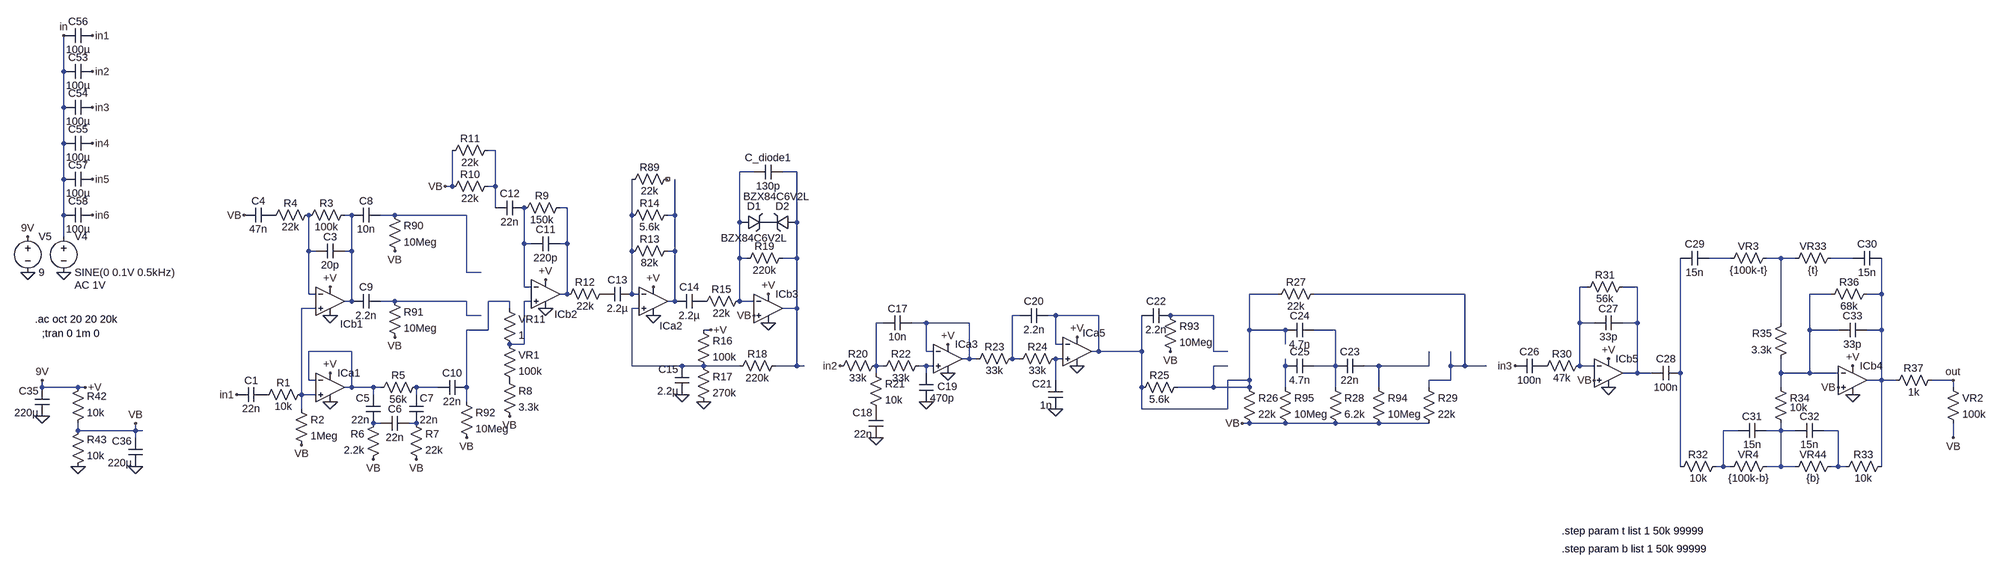
[diagram p0: schematic PocketAmpMK2.asc]
PocketAmpMK2.asc, the LTspice schematic file:
Version 4
SHEET 1 2672 1052
WIRE -1776 -928 -1776 -1008
WIRE -1776 -848 -1776 -928
WIRE -1776 -768 -1776 -848
WIRE -656 -752 -672 -752
WIRE -80 -704 -112 -704
WIRE 16 -704 -16 -704
WIRE -1776 -688 -1776 -768
WIRE -752 -672 -752 -752
WIRE -752 -672 -768 -672
WIRE -656 -672 -656 -752
WIRE -656 -672 -672 -672
WIRE -656 -624 -656 -672
WIRE -496 -624 -512 -624
WIRE -1776 -608 -1776 -688
WIRE -976 -608 -992 -608
WIRE -880 -608 -912 -608
WIRE -720 -608 -880 -608
WIRE -352 -608 -352 -688
WIRE -256 -608 -256 -688
WIRE -256 -608 -272 -608
WIRE -112 -592 -112 -704
WIRE 16 -592 16 -704
WIRE -1776 -560 -1776 -608
WIRE -592 -544 -592 -624
WIRE -576 -544 -592 -544
WIRE -496 -544 -496 -624
WIRE -496 -544 -512 -544
WIRE -1072 -528 -1072 -608
WIRE -1056 -528 -1072 -528
WIRE -976 -528 -976 -608
WIRE -976 -528 -992 -528
WIRE -352 -528 -352 -608
WIRE -256 -528 -256 -608
WIRE -256 -528 -272 -528
WIRE -112 -512 -112 -592
WIRE -96 -512 -112 -512
WIRE 16 -512 16 -592
WIRE 16 -512 -16 -512
WIRE 2096 -512 2048 -512
WIRE 2208 -512 2176 -512
WIRE 2240 -512 2208 -512
WIRE 2368 -512 2320 -512
WIRE -720 -480 -720 -608
WIRE -688 -480 -720 -480
WIRE -592 -448 -592 -544
WIRE -576 -448 -592 -448
WIRE 1776 -448 1760 -448
WIRE 1888 -448 1856 -448
WIRE -1072 -432 -1072 -528
WIRE -1056 -432 -1072 -432
WIRE -496 -432 -496 -544
WIRE -496 -432 -512 -432
WIRE -352 -432 -352 -528
WIRE -336 -432 -352 -432
WIRE 1088 -432 1024 -432
WIRE 1504 -432 1168 -432
WIRE 2320 -432 2272 -432
WIRE 2432 -432 2432 -512
WIRE 2432 -432 2400 -432
WIRE -976 -416 -976 -528
WIRE -976 -416 -992 -416
WIRE -880 -416 -912 -416
WIRE -720 -416 -880 -416
WIRE -624 -416 -672 -416
WIRE -576 -416 -592 -416
WIRE -256 -416 -256 -528
WIRE -256 -416 -272 -416
WIRE -112 -416 -112 -512
WIRE -80 -416 -112 -416
WIRE -1056 -400 -1088 -400
WIRE -624 -400 -624 -416
WIRE -336 -400 -352 -400
WIRE 16 -400 16 -512
WIRE 16 -400 -16 -400
WIRE -720 -384 -720 -416
WIRE -688 -384 -720 -384
WIRE 512 -384 496 -384
WIRE 592 -384 576 -384
WIRE 688 -384 592 -384
WIRE 944 -384 848 -384
WIRE 208 -368 192 -368
WIRE 304 -368 272 -368
WIRE 400 -368 304 -368
WIRE 1760 -368 1760 -448
WIRE 1792 -368 1760 -368
WIRE 1888 -368 1888 -448
WIRE 1888 -368 1856 -368
WIRE 2208 -368 2208 -512
WIRE -672 -352 -672 -416
WIRE -672 -352 -720 -352
WIRE -176 -352 -192 -352
WIRE 1024 -352 1024 -432
WIRE 1104 -352 1024 -352
WIRE 1216 -352 1168 -352
WIRE 2272 -352 2272 -432
WIRE 2336 -352 2272 -352
WIRE 2432 -352 2432 -432
WIRE 2432 -352 2400 -352
WIRE -592 -320 -592 -416
WIRE -592 -320 -624 -320
WIRE 592 -320 592 -384
WIRE 608 -320 592 -320
WIRE 1104 -320 1104 -352
WIRE -976 -304 -1072 -304
WIRE 304 -304 304 -368
WIRE 320 -304 304 -304
WIRE 688 -304 688 -384
WIRE 688 -304 672 -304
WIRE 784 -304 784 -384
WIRE 784 -304 688 -304
WIRE 944 -304 944 -384
WIRE 976 -304 944 -304
WIRE 400 -288 400 -368
WIRE 400 -288 384 -288
WIRE 416 -288 400 -288
WIRE 496 -288 496 -384
WIRE 512 -288 496 -288
WIRE 608 -288 592 -288
WIRE -352 -272 -352 -400
WIRE -240 -272 -352 -272
WIRE -192 -272 -240 -272
WIRE -112 -272 -192 -272
WIRE 16 -272 16 -400
WIRE 16 -272 -32 -272
WIRE 32 -272 16 -272
WIRE 192 -272 192 -368
WIRE 208 -272 192 -272
WIRE 304 -272 288 -272
WIRE 320 -272 304 -272
WIRE 976 -272 944 -272
WIRE 1104 -272 1104 -288
WIRE 1216 -272 1216 -352
WIRE 1216 -272 1168 -272
WIRE 1312 -272 1280 -272
WIRE 1424 -272 1424 -304
WIRE 1424 -272 1312 -272
WIRE 1472 -272 1472 -304
WIRE 1504 -272 1504 -432
WIRE 1504 -272 1472 -272
WIRE 1552 -272 1504 -272
WIRE 1760 -272 1760 -368
WIRE 1792 -272 1760 -272
WIRE 192 -256 192 -272
WIRE 304 -256 304 -272
WIRE 1888 -256 1888 -368
WIRE 1888 -256 1856 -256
WIRE 1920 -256 1888 -256
WIRE 1984 -256 1984 -512
WIRE 2208 -256 2208 -288
WIRE 2272 -256 2272 -352
WIRE 2272 -256 2208 -256
WIRE 2336 -256 2272 -256
WIRE -1072 -240 -1072 -304
WIRE -1056 -240 -1072 -240
WIRE 592 -240 592 -288
WIRE 1024 -240 1024 -352
WIRE 1024 -240 976 -240
WIRE 1472 -240 1472 -272
WIRE 1472 -240 1424 -240
WIRE 2432 -240 2432 -352
WIRE 2432 -240 2400 -240
WIRE 2464 -240 2432 -240
WIRE 2592 -240 2544 -240
WIRE -1824 -224 -1824 -240
WIRE -1744 -224 -1824 -224
WIRE -1728 -224 -1744 -224
WIRE -976 -224 -976 -304
WIRE -976 -224 -992 -224
WIRE -928 -224 -976 -224
WIRE -912 -224 -928 -224
WIRE -784 -224 -832 -224
WIRE -720 -224 -720 -352
WIRE 784 -224 784 -304
WIRE 944 -224 944 -272
WIRE 944 -224 864 -224
WIRE 1024 -224 1024 -240
WIRE 1024 -224 944 -224
WIRE 1104 -224 1104 -272
WIRE 1216 -224 1216 -272
WIRE 1312 -224 1312 -272
WIRE 1424 -224 1424 -240
WIRE 2208 -224 2208 -256
WIRE 2592 -224 2592 -240
WIRE -1088 -208 -1088 -400
WIRE -1056 -208 -1088 -208
WIRE -928 -208 -928 -224
WIRE -832 -208 -832 -224
WIRE -720 -192 -720 -224
WIRE -1088 -176 -1088 -208
WIRE 784 -176 784 -224
WIRE 976 -176 976 -240
WIRE 976 -176 784 -176
WIRE -912 -144 -928 -144
WIRE -832 -144 -848 -144
WIRE 1024 -144 1008 -144
WIRE 1104 -144 1024 -144
WIRE 1216 -144 1104 -144
WIRE 1312 -144 1216 -144
WIRE 1424 -144 1312 -144
WIRE -1744 -128 -1744 -144
WIRE -1616 -128 -1616 -144
WIRE -1616 -128 -1744 -128
WIRE -1600 -128 -1616 -128
WIRE 2112 -128 2080 -128
WIRE 2208 -128 2208 -144
WIRE 2208 -128 2176 -128
WIRE 2240 -128 2208 -128
WIRE 2336 -128 2304 -128
WIRE -1616 -112 -1616 -128
WIRE 2592 -112 2592 -144
WIRE 1984 -48 1984 -256
WIRE 2080 -48 2080 -128
WIRE 2080 -48 2064 -48
WIRE 2096 -48 2080 -48
WIRE 2208 -48 2208 -128
WIRE 2208 -48 2176 -48
WIRE 2240 -48 2208 -48
WIRE 2336 -48 2336 -128
WIRE 2336 -48 2320 -48
WIRE 2352 -48 2336 -48
WIRE 2432 -48 2432 -240
FLAG -1232 -208 in1
FLAG -1024 -192 0
FLAG -1024 -256 +V
FLAG -1024 -448 +V
FLAG -1024 -384 0
FLAG -192 -192 0
FLAG -240 -208 0
FLAG -304 -448 +V
FLAG -304 -384 0
FLAG 192 -112 0
FLAG 304 -192 0
FLAG 352 -320 +V
FLAG 352 -256 0
FLAG 592 -176 0
FLAG 640 -336 +V
FLAG 640 -272 0
FLAG -1824 -160 0
FLAG -1744 -48 0
FLAG -1616 -48 0
FLAG -1616 -144 VB
FLAG -1824 -240 9V
FLAG -1776 -480 0
FLAG -1776 -1008 in
FLAG -1856 -480 0
FLAG -1856 -560 9V
FLAG -1712 -1008 in1
FLAG -1712 -928 in2
FLAG -1712 -848 in3
FLAG -1712 -768 in4
FLAG -1712 -688 in5
FLAG -1712 -608 in6
FLAG -1728 -224 +V
FLAG -1088 -96 VB
FLAG -720 -112 VB
FLAG -928 -64 VB
FLAG -832 -64 VB
FLAG -1216 -608 VB
FLAG -880 -336 VB
FLAG -880 -528 VB
FLAG -544 -464 +V
FLAG -544 -400 0
FLAG -624 -160 VB
FLAG -768 -672 VB
FLAG -48 -432 +V
FLAG -48 -368 0
FLAG -176 -352 +V
FLAG -80 -384 VB
FLAG 848 -304 VB
FLAG 1008 -144 VB
FLAG 1824 -288 +V
FLAG 1824 -224 0
FLAG 1792 -240 VB
FLAG 2368 -208 0
FLAG 2368 -272 +V
FLAG 2336 -224 VB
FLAG 2592 -112 VB
FLAG 112 -272 in2
FLAG 1616 -272 in3
FLAG 2592 -240 out
SYMBOL cap -1168 -224 R90
WINDOW 0 0 32 VBottom 2
WINDOW 3 32 32 VTop 2
SYMATTR InstName C1
SYMATTR Value 22n
SYMBOL res -1104 -192 R0
SYMATTR InstName R2
SYMATTR Value 1Meg
SYMBOL UniversalOpamp2 -1024 -224 R0
SYMATTR InstName ICa1
SYMBOL res -816 -240 R90
WINDOW 0 5 56 VBottom 2
WINDOW 3 27 56 VTop 2
SYMATTR InstName R5
SYMATTR Value 56k
SYMBOL cap -912 -144 R180
WINDOW 0 24 56 Left 2
WINDOW 3 24 8 Left 2
SYMATTR InstName C5
SYMATTR Value 22n
SYMBOL cap -848 -144 M180
WINDOW 0 24 56 Left 2
WINDOW 3 24 8 Left 2
SYMATTR InstName C7
SYMATTR Value 22n
SYMBOL cap -848 -160 R90
WINDOW 0 0 32 VBottom 2
WINDOW 3 32 32 VTop 2
SYMATTR InstName C6
SYMATTR Value 22n
SYMBOL res -912 -160 M0
SYMATTR InstName R6
SYMATTR Value 2.2k
SYMBOL res -848 -160 R0
SYMATTR InstName R7
SYMATTR Value 22k
SYMBOL cap -720 -240 R90
WINDOW 0 0 32 VBottom 2
WINDOW 3 32 32 VTop 2
SYMATTR InstName C10
SYMATTR Value 22n
SYMBOL res -736 -208 R0
SYMATTR InstName R92
SYMATTR Value 10Meg
SYMBOL UniversalOpamp2 -1024 -416 R0
WINDOW 0 22 51 Left 2
SYMATTR InstName ICb1
SYMBOL cap -992 -544 R90
WINDOW 0 0 32 VBottom 2
WINDOW 3 32 32 VTop 2
SYMATTR InstName C3
SYMATTR Value 20p
SYMBOL res -976 -624 R90
WINDOW 0 5 56 VBottom 2
WINDOW 3 27 56 VTop 2
SYMATTR InstName R3
SYMATTR Value 100k
SYMBOL res -1056 -624 R90
WINDOW 0 5 56 VBottom 2
WINDOW 3 27 56 VTop 2
SYMATTR InstName R4
SYMATTR Value 22k
SYMBOL cap -1152 -624 R90
WINDOW 0 0 32 VBottom 2
WINDOW 3 32 32 VTop 2
SYMATTR InstName C4
SYMATTR Value 47n
SYMBOL res -400 -448 R90
WINDOW 0 5 56 VBottom 2
WINDOW 3 27 56 VTop 2
SYMATTR InstName R12
SYMATTR Value 22k
SYMBOL cap -352 -448 R90
WINDOW 0 0 32 VBottom 2
WINDOW 3 32 32 VTop 2
SYMATTR InstName C13
SYMATTR Value 2.2µ
SYMBOL UniversalOpamp2 -304 -416 R0
WINDOW 0 14 55 Left 2
SYMATTR InstName ICa2
SYMBOL res -208 -368 R0
SYMATTR InstName R16
SYMATTR Value 100k
SYMBOL res -208 -288 R0
SYMATTR InstName R17
SYMATTR Value 270k
SYMBOL cap -224 -208 R180
WINDOW 0 24 56 Left 2
WINDOW 3 24 8 Left 2
SYMATTR InstName C15
SYMATTR Value 2.2µ
SYMBOL cap -192 -432 R90
WINDOW 0 0 32 VBottom 2
WINDOW 3 32 32 VTop 2
SYMATTR InstName C14
SYMATTR Value 2.2µ
SYMBOL res 0 -528 R90
WINDOW 0 5 56 VBottom 2
WINDOW 3 27 56 VTop 2
SYMATTR InstName R19
SYMATTR Value 220k
SYMBOL zener 16 -608 R90
WINDOW 0 -4 32 VBottom 2
WINDOW 3 -57 46 VTop 2
SYMATTR InstName D2
SYMATTR Value BZX84C6V2L
SYMBOL zener -112 -608 M90
WINDOW 0 -4 32 VBottom 2
WINDOW 3 36 32 VTop 2
SYMATTR InstName D1
SYMATTR Value BZX84C6V2L
SYMBOL res 208 -288 R90
WINDOW 0 5 56 VBottom 2
WINDOW 3 27 56 VTop 2
SYMATTR InstName R20
SYMATTR Value 33k
SYMBOL res 304 -288 R90
WINDOW 0 5 56 VBottom 2
WINDOW 3 27 56 VTop 2
SYMATTR InstName R22
SYMATTR Value 33k
SYMBOL res 176 -272 R0
SYMATTR InstName R21
SYMATTR Value 10k
SYMBOL cap 208 -112 R180
WINDOW 0 24 56 Left 2
WINDOW 3 24 8 Left 2
SYMATTR InstName C18
SYMATTR Value 22n
SYMBOL cap 288 -192 M180
WINDOW 0 41 34 Left 2
WINDOW 3 24 8 Left 2
SYMATTR InstName C19
SYMATTR Value 470p
SYMBOL cap 272 -384 R90
WINDOW 0 0 32 VBottom 2
WINDOW 3 32 32 VTop 2
SYMATTR InstName C17
SYMATTR Value 10n
SYMBOL UniversalOpamp2 352 -288 R0
SYMATTR InstName ICa3
SYMBOL res 512 -304 R90
WINDOW 0 5 56 VBottom 2
WINDOW 3 27 56 VTop 2
SYMATTR InstName R23
SYMATTR Value 33k
SYMBOL res 608 -304 R90
WINDOW 0 5 56 VBottom 2
WINDOW 3 27 56 VTop 2
SYMATTR InstName R24
SYMATTR Value 33k
SYMBOL cap 608 -176 R180
WINDOW 0 24 56 Left 2
WINDOW 3 24 8 Left 2
SYMATTR InstName C21
SYMATTR Value 1n
SYMBOL cap 576 -400 R90
WINDOW 0 0 32 VBottom 2
WINDOW 3 32 32 VTop 2
SYMATTR InstName C20
SYMATTR Value 2.2n
SYMBOL UniversalOpamp2 640 -304 R0
WINDOW 0 12 -41 Left 2
SYMATTR InstName ICa5
SYMBOL res 1184 -448 R90
WINDOW 0 5 56 VBottom 2
WINDOW 3 27 56 VTop 2
SYMATTR InstName R27
SYMATTR Value 22k
SYMBOL res -1072 -224 R90
WINDOW 0 5 56 VBottom 2
WINDOW 3 27 56 VTop 2
SYMATTR InstName R1
SYMATTR Value 10k
SYMBOL cap -1808 -160 R180
WINDOW 0 24 56 Left 2
WINDOW 3 24 8 Left 2
SYMATTR InstName C35
SYMATTR Value 220µ
SYMBOL res -1760 -128 M180
WINDOW 0 36 76 Left 2
WINDOW 3 36 40 Left 2
SYMATTR InstName R42
SYMATTR Value 10k
SYMBOL res -1760 -32 M180
WINDOW 0 36 76 Left 2
WINDOW 3 36 40 Left 2
SYMATTR InstName R43
SYMATTR Value 10k
SYMBOL cap -1600 -48 R180
WINDOW 0 24 56 Left 2
WINDOW 3 24 8 Left 2
SYMATTR InstName C36
SYMATTR Value 220µ
SYMBOL voltage -1776 -576 R0
WINDOW 123 24 124 Left 2
WINDOW 39 0 0 Left 2
SYMATTR Value2 AC 1V
SYMATTR InstName V4
SYMATTR Value SINE(0 0.1V 0.5kHz)
SYMBOL voltage -1856 -576 R0
WINDOW 123 0 0 Left 0
WINDOW 39 0 0 Left 0
SYMATTR InstName V5
SYMATTR Value 9
SYMBOL cap -1712 -944 R90
WINDOW 0 0 32 VBottom 2
WINDOW 3 32 32 VTop 2
SYMATTR InstName C53
SYMATTR Value 100µ
SYMBOL cap -1712 -864 R90
WINDOW 0 0 32 VBottom 2
WINDOW 3 32 32 VTop 2
SYMATTR InstName C54
SYMATTR Value 100µ
SYMBOL cap -1712 -784 R90
WINDOW 0 0 32 VBottom 2
WINDOW 3 32 32 VTop 2
SYMATTR InstName C55
SYMATTR Value 100µ
SYMBOL cap -1712 -1024 R90
WINDOW 0 0 32 VBottom 2
WINDOW 3 32 32 VTop 2
SYMATTR InstName C56
SYMATTR Value 100µ
SYMBOL cap -1712 -704 R90
WINDOW 0 0 32 VBottom 2
WINDOW 3 32 32 VTop 2
SYMATTR InstName C57
SYMATTR Value 100µ
SYMBOL cap -1712 -624 R90
WINDOW 0 0 32 VBottom 2
WINDOW 3 32 32 VTop 2
SYMATTR InstName C58
SYMATTR Value 100µ
SYMBOL cap -912 -432 R90
WINDOW 0 0 32 VBottom 2
WINDOW 3 32 32 VTop 2
SYMATTR InstName C9
SYMATTR Value 2.2n
SYMBOL cap -912 -624 R90
WINDOW 0 0 32 VBottom 2
WINDOW 3 32 32 VTop 2
SYMATTR InstName C8
SYMATTR Value 10n
SYMBOL res -896 -432 R0
SYMATTR InstName R91
SYMATTR Value 10Meg
SYMBOL res -896 -624 R0
SYMATTR InstName R90
SYMATTR Value 10Meg
SYMBOL UniversalOpamp2 -544 -432 R0
WINDOW 0 20 45 Left 2
SYMATTR InstName ICb2
SYMBOL res -640 -416 R0
SYMATTR InstName VR11
SYMATTR Value 1
SYMBOL res -640 -336 R0
SYMATTR InstName VR1
SYMATTR Value 100k
SYMBOL res -640 -256 R0
SYMATTR InstName R8
SYMATTR Value 3.3k
SYMBOL cap -512 -560 R90
WINDOW 0 0 32 VBottom 2
WINDOW 3 32 32 VTop 2
SYMATTR InstName C11
SYMATTR Value 220p
SYMBOL res -496 -640 R90
WINDOW 0 5 56 VBottom 2
WINDOW 3 27 56 VTop 2
SYMATTR InstName R9
SYMATTR Value 150k
SYMBOL cap -592 -640 R90
WINDOW 0 0 32 VBottom 2
WINDOW 3 32 32 VTop 2
SYMATTR InstName C12
SYMATTR Value 22n
SYMBOL res -656 -768 R90
WINDOW 0 5 56 VBottom 2
WINDOW 3 27 56 VTop 2
SYMATTR InstName R11
SYMATTR Value 22k
SYMBOL res -656 -688 R90
WINDOW 0 5 56 VBottom 2
WINDOW 3 27 56 VTop 2
SYMATTR InstName R10
SYMATTR Value 22k
SYMBOL res -256 -544 R90
WINDOW 0 5 56 VBottom 2
WINDOW 3 27 56 VTop 2
SYMATTR InstName R13
SYMATTR Value 82k
SYMBOL res -256 -624 R90
WINDOW 0 5 56 VBottom 2
WINDOW 3 27 56 VTop 2
SYMATTR InstName R14
SYMATTR Value 5.6k
SYMBOL res -256 -704 R90
WINDOW 0 5 56 VBottom 2
WINDOW 3 27 56 VTop 2
SYMATTR InstName R89
SYMATTR Value 22k
SYMBOL res -96 -432 R90
WINDOW 0 5 56 VBottom 2
WINDOW 3 27 56 VTop 2
SYMATTR InstName R15
SYMATTR Value 22k
SYMBOL UniversalOpamp2 -48 -400 R0
SYMATTR InstName ICb3
SYMBOL res -16 -288 R90
WINDOW 0 5 56 VBottom 2
WINDOW 3 27 56 VTop 2
SYMATTR InstName R18
SYMATTR Value 220k
SYMBOL cap 848 -400 R90
WINDOW 0 0 32 VBottom 2
WINDOW 3 32 32 VTop 2
SYMATTR InstName C22
SYMATTR Value 2.2n
SYMBOL res 832 -400 R0
SYMATTR InstName R93
SYMATTR Value 10Meg
SYMBOL res 880 -240 R90
WINDOW 0 5 56 VBottom 2
WINDOW 3 27 56 VTop 2
SYMATTR InstName R25
SYMATTR Value 5.6k
SYMBOL res 1008 -240 R0
SYMATTR InstName R26
SYMATTR Value 22k
SYMBOL res 1088 -240 R0
SYMATTR InstName R95
SYMATTR Value 10Meg
SYMBOL res 1200 -240 R0
SYMATTR InstName R28
SYMATTR Value 6.2k
SYMBOL res 1296 -240 R0
SYMATTR InstName R94
SYMATTR Value 10Meg
SYMBOL res 1408 -240 R0
SYMATTR InstName R29
SYMATTR Value 22k
SYMBOL cap 1168 -368 R90
WINDOW 0 0 32 VBottom 2
WINDOW 3 32 32 VTop 2
SYMATTR InstName C24
SYMATTR Value 4.7n
SYMBOL cap 1168 -288 R90
WINDOW 0 0 32 VBottom 2
WINDOW 3 32 32 VTop 2
SYMATTR InstName C25
SYMATTR Value 4.7n
SYMBOL cap 1280 -288 R90
WINDOW 0 0 32 VBottom 2
WINDOW 3 32 32 VTop 2
SYMATTR InstName C23
SYMATTR Value 22n
SYMBOL res 1872 -464 R90
WINDOW 0 5 56 VBottom 2
WINDOW 3 27 56 VTop 2
SYMATTR InstName R31
SYMATTR Value 56k
SYMBOL res 1776 -288 R90
WINDOW 0 5 56 VBottom 2
WINDOW 3 27 56 VTop 2
SYMATTR InstName R30
SYMATTR Value 47k
SYMBOL UniversalOpamp2 1824 -256 R0
SYMATTR InstName ICb5
SYMBOL cap 1856 -384 R90
WINDOW 0 0 32 VBottom 2
WINDOW 3 32 32 VTop 2
SYMATTR InstName C27
SYMATTR Value 33p
SYMBOL cap 1680 -288 R90
WINDOW 0 0 32 VBottom 2
WINDOW 3 32 32 VTop 2
SYMATTR InstName C26
SYMATTR Value 100n
SYMBOL res 2576 -240 R0
SYMATTR InstName VR2
SYMATTR Value 100k
SYMBOL UniversalOpamp2 2368 -240 R0
SYMATTR InstName ICb4
SYMBOL res 2192 -240 R0
WINDOW 3 36 61 Left 2
SYMATTR Value 10k
SYMATTR InstName R34
SYMBOL res 2336 -528 R90
WINDOW 0 5 56 VBottom 2
WINDOW 3 27 56 VTop 2
SYMATTR InstName VR33
SYMATTR Value {t}
SYMBOL res 2192 -528 R90
WINDOW 0 5 56 VBottom 2
WINDOW 3 27 56 VTop 2
SYMATTR InstName VR3
SYMATTR Value {100k-t}
SYMBOL cap 1984 -272 R90
WINDOW 0 0 32 VBottom 2
WINDOW 3 32 32 VTop 2
SYMATTR InstName C28
SYMATTR Value 100n
SYMBOL cap 2400 -368 R90
WINDOW 0 0 32 VBottom 2
WINDOW 3 32 32 VTop 2
SYMATTR InstName C33
SYMATTR Value 33p
SYMBOL res 2416 -448 R90
WINDOW 0 5 56 VBottom 2
WINDOW 3 27 56 VTop 2
SYMATTR InstName R36
SYMATTR Value 68k
SYMBOL res 2080 -64 R90
WINDOW 0 5 56 VBottom 2
WINDOW 3 27 56 VTop 2
SYMATTR InstName R32
SYMATTR Value 10k
SYMBOL res 2448 -64 R90
WINDOW 0 5 56 VBottom 2
WINDOW 3 27 56 VTop 2
SYMATTR InstName R33
SYMATTR Value 10k
SYMBOL cap 2048 -528 R90
WINDOW 0 0 32 VBottom 2
WINDOW 3 32 32 VTop 2
SYMATTR InstName C29
SYMATTR Value 15n
SYMBOL cap 2432 -528 R90
WINDOW 0 0 32 VBottom 2
WINDOW 3 32 32 VTop 2
SYMATTR InstName C30
SYMATTR Value 15n
SYMBOL cap 2176 -144 R90
WINDOW 0 0 32 VBottom 2
WINDOW 3 32 32 VTop 2
SYMATTR InstName C31
SYMATTR Value 15n
SYMBOL cap 2304 -144 R90
WINDOW 0 0 32 VBottom 2
WINDOW 3 32 32 VTop 2
SYMATTR InstName C32
SYMATTR Value 15n
SYMBOL res 2224 -384 M0
SYMATTR InstName R35
SYMATTR Value 3.3k
SYMBOL res 2192 -64 R90
WINDOW 0 5 56 VBottom 2
WINDOW 3 27 56 VTop 2
SYMATTR InstName VR4
SYMATTR Value {100k-b}
SYMBOL res 2336 -64 R90
WINDOW 0 5 56 VBottom 2
WINDOW 3 27 56 VTop 2
SYMATTR InstName VR44
SYMATTR Value {b}
SYMBOL res 2560 -256 R90
WINDOW 0 5 56 VBottom 2
WINDOW 3 27 56 VTop 2
SYMATTR InstName R37
SYMATTR Value 1k
SYMBOL cap -16 -720 R90
WINDOW 0 0 32 VBottom 2
WINDOW 3 32 32 VTop 2
SYMATTR InstName C_diode1
SYMATTR Value 130p
TEXT -1840 -376 Left 2 !.ac oct 20 20 20k
TEXT -1824 -344 Left 2 !;tran 0 1m 0
TEXT 1720 96 Left 2 !.step param t list 1 50k 99999
TEXT 1720 136 Left 2 !.step param b list 1 50k 99999

The netlist it stands for:
* PocketAmpMK2.asc
C1 P001 in1 22n
R2 N023 VB 1Meg
XICa1 N023 N030 9V 0 N030 level.2 Avol=1Meg GBW=10Meg Slew=10Meg ilimit=25m rail=0 Vos=0 phimargin=45 en=0 enk=0 in=0 ink=0 Rin=500Meg  ; pins IN+ IN- V+ V- OUT
R5 N036 N030 56k
C5 N037 N030 22n
C7 N038 N036 22n
C6 N038 N037 22n
R6 N037 VB 2.2k
R7 N038 VB 22k
C10 N021 N036 22n
R92 N021 VB 10Meg
XICb1 N023 N010 9V 0 N005 level.2 Avol=1Meg GBW=10Meg Slew=10Meg ilimit=25m rail=0 Vos=0 phimargin=45 en=0 enk=0 in=0 ink=0 Rin=500Meg  ; pins IN+ IN- V+ V- OUT
C3 N005 N010 20p
R3 N005 N010 100k
R4 N010 P002 22k
C4 P002 VB 47n
R12 P003 N004 22k
C13 N007 P003 2.2µ
XICa2 N024 N007 9V 0 N008 level.2 Avol=1Meg GBW=10Meg Slew=10Meg ilimit=25m rail=0 Vos=0 phimargin=45 en=0 enk=0 in=0 ink=0 Rin=500Meg  ; pins IN+ IN- V+ V- OUT
R16 9V N024 100k
R17 N024 0 270k
C15 0 N024 2.2µ
C14 P004 N008 2.2µ
R19 N003 N002 220k
D2 N003 P005 BZX84C6V2L
D1 N002 P005 BZX84C6V2L
R20 N027 in2 33k
R22 N032 N027 33k
R21 N027 P006 10k
C18 0 P006 22n
C19 0 N032 470p
C17 N028 N027 10n
XICa3 N032 N028 9V 0 N028 level.2 Avol=1Meg GBW=10Meg Slew=10Meg ilimit=25m rail=0 Vos=0 phimargin=45 en=0 enk=0 in=0 ink=0 Rin=500Meg  ; pins IN+ IN- V+ V- OUT
R23 N025 N028 33k
R24 N031 N025 33k
C21 0 N031 1n
C20 N016 N025 2.2n
XICa5 N031 N016 9V 0 N016 level.2 Avol=1Meg GBW=10Meg Slew=10Meg ilimit=25m rail=0 Vos=0 phimargin=45 en=0 enk=0 in=0 ink=0 Rin=500Meg  ; pins IN+ IN- V+ V- OUT
R27 N017 N016 22k
R1 N023 P001 10k
C35 0 9V 220µ
R42 VB 9V 10k
R43 0 VB 10k
C36 0 VB 220µ
V4 in 0 SINE(0 0.1V 0.5kHz) AC 1V
V5 9V 0 9
C53 in2 in 100µ
C54 in3 in 100µ
C55 in4 in 100µ
C56 in1 in 100µ
C57 in5 in 100µ
C58 in6 in 100µ
C9 N020 N005 2.2n
C8 N006 N005 10n
R91 N020 VB 10Meg
R90 N006 VB 10Meg
XICb2 N022 N009 9V 0 N004 level.2 Avol=1Meg GBW=10Meg Slew=10Meg ilimit=25m rail=0 Vos=0 phimargin=45 en=0 enk=0 in=0 ink=0 Rin=500Meg  ; pins IN+ IN- V+ V- OUT
R§VR11 N021 N022 1
R§VR1 N022 P007 100k
R8 P007 VB 3.3k
C11 N004 N009 220p
R9 N004 N009 150k
C12 N009 N001 22n
R11 N001 VB 22k
R10 N001 VB 22k
R13 N008 N007 82k
R14 N008 N007 5.6k
R89 NC_01 N007 22k
R15 N002 P004 22k
XICb3 VB N002 9V 0 N003 level.2 Avol=1Meg GBW=10Meg Slew=10Meg ilimit=25m rail=0 Vos=0 phimargin=45 en=0 enk=0 in=0 ink=0 Rin=500Meg  ; pins IN+ IN- V+ V- OUT
R18 N003 N024 220k
C22 N026 N016 2.2n
R93 N026 VB 10Meg
R25 N016 N016 5.6k
R26 N016 VB 22k
R95 N033 VB 10Meg
R28 N029 VB 6.2k
R94 N034 VB 10Meg
R29 N017 VB 22k
C24 N029 N016 4.7n
C25 N029 N033 4.7n
C23 N034 N029 22n
R31 N015 N014 56k
R30 N014 P008 47k
XICb5 VB N014 9V 0 N015 level.2 Avol=1Meg GBW=10Meg Slew=10Meg ilimit=25m rail=0 Vos=0 phimargin=45 en=0 enk=0 in=0 ink=0 Rin=500Meg  ; pins IN+ IN- V+ V- OUT
C27 N015 N014 33p
C26 P008 in3 100n
R§VR2 out VB 100k
XICb4 VB N018 9V 0 N019 level.2 Avol=1Meg GBW=10Meg Slew=10Meg ilimit=25m rail=0 Vos=0 phimargin=45 en=0 enk=0 in=0 ink=0 Rin=500Meg  ; pins IN+ IN- V+ V- OUT
R34 N018 N040 10k
R§VR33 N013 N012 {t}
R§VR3 N012 N011 {100k-t}
C28 N035 N015 100n
C33 N019 N018 33p
R36 N019 N018 68k
R32 N039 N035 10k
R33 N019 N041 10k
C29 N011 N035 15n
C30 N019 N013 15n
C31 N040 N039 15n
C32 N041 N040 15n
R35 N012 N018 3.3k
R§VR4 N040 N039 {100k-b}
R§VR44 N041 N040 {b}
R37 out N019 1k
C_diode1 N003 N002 130p
.model D D
.lib standard.dio
.ac oct 20 20 20k
;tran 0 1m 0
.step param t list 1 50k 99999
.step param b list 1 50k 99999
.lib UniversalOpamps2.sub
.backanno
.end